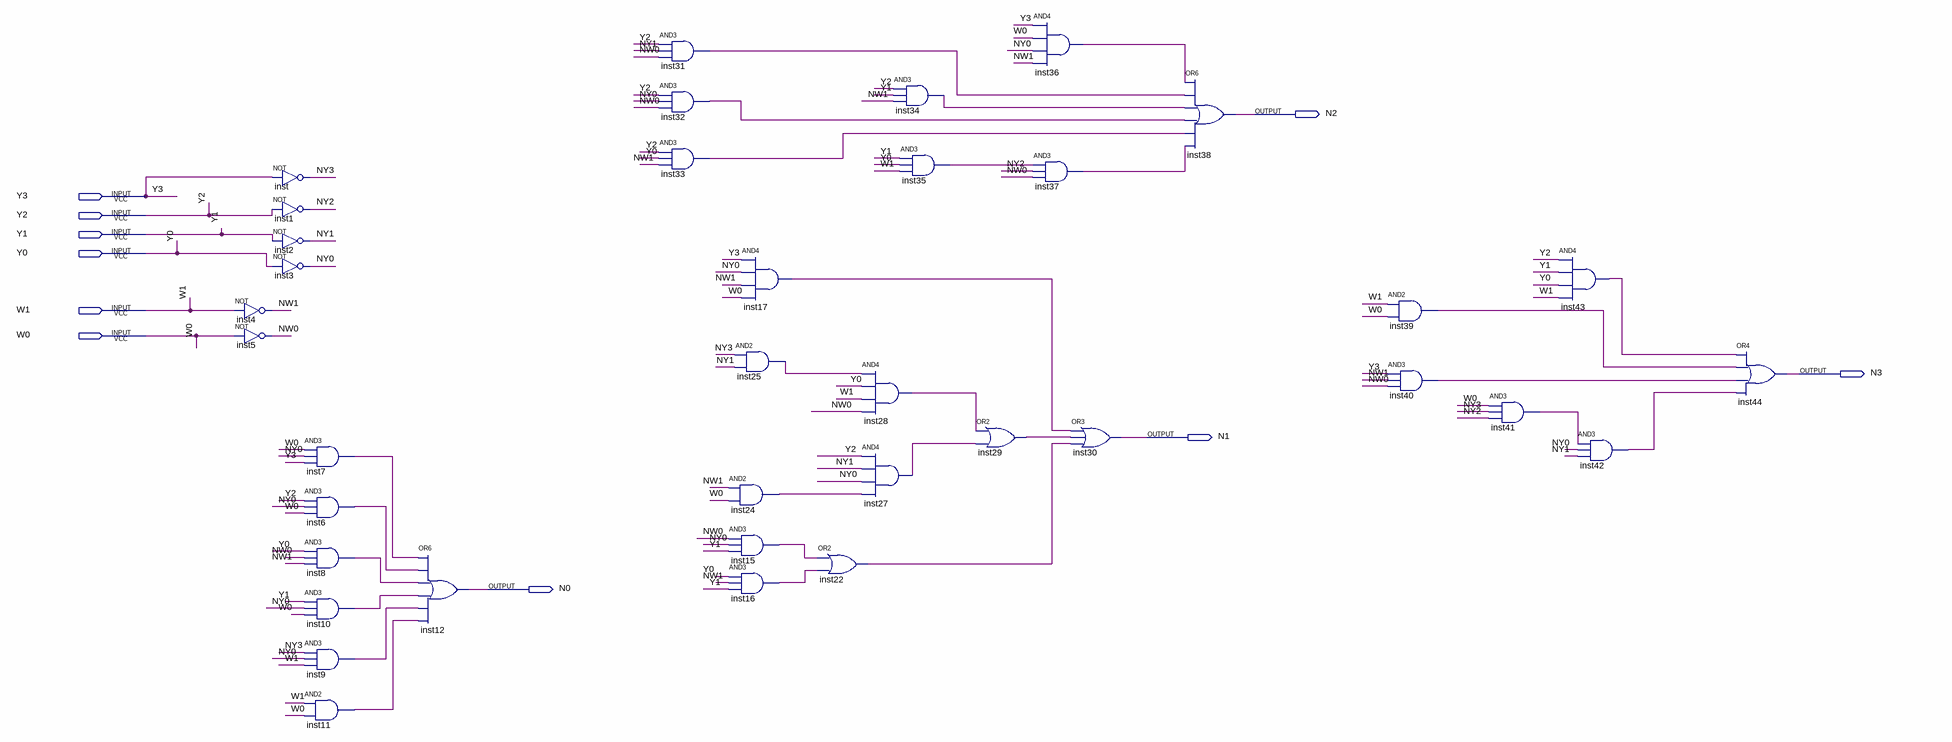
[diagram p0: schematic sheet]
// Quartus schematic CCEntrada.bdf as structural Verilog: 37 symbols, 10 pins
module CCEntrada (
  input  Y3,
  input  Y2,
  input  Y1,
  input  Y0,
  input  W1,
  input  W0,
  output N2,
  output N3,
  output N1,
  output N0
);

  wire inst6_out, inst7_out, inst8_out, inst9_out, inst10_out, inst11_out, inst15_out, inst16_out,
       inst17_out, inst22_out, inst24_out, inst25_out, inst27_out, inst28_out, inst29_out, inst31_out,
       inst32_out, inst33_out, inst34_out, inst35_out, inst36_out, inst37_out, inst39_out, inst40_out,
       inst41_out, inst42_out, inst43_out, NW0, NW1, NY0, NY1, NY2, NY3;

  not inst4 (NW1, W1);
  not inst5 (NW0, W0);
  not inst (NY3, Y3);
  not inst1 (NY2, Y2);
  not inst2 (NY1, Y1);
  not inst3 (NY0, Y0);
  and inst7 (inst7_out, W0, NY0, Y3);
  and inst6 (inst6_out, Y2, NY0, W0);
  and inst8 (inst8_out, Y0, NW0, NW1);
  and inst10 (inst10_out, Y1, NY0, W0);
  and inst9 (inst9_out, NY3, NY0, W1);
  and inst11 (inst11_out, W1, W0);
  or inst12 (N0, inst7_out, inst6_out, inst8_out, inst10_out, inst9_out, inst11_out);
  and inst31 (inst31_out, Y2, NY1, NW0);
  and inst32 (inst32_out, Y2, NY0, NW0);
  and inst33 (inst33_out, Y2, Y0, NW1);
  and inst17 (inst17_out, Y3, NY0, NW1, W0);
  and inst25 (inst25_out, NY3, NY1);
  and inst24 (inst24_out, NW1, W0);
  and inst15 (inst15_out, NW0, NY0, Y1);
  and inst16 (inst16_out, Y0, NW1, Y1);
  or inst22 (inst22_out, inst15_out, inst16_out);
  and inst28 (inst28_out, inst25_out, Y0, W1, NW0);
  and inst27 (inst27_out, Y2, NY1, NY0, inst24_out);
  and inst34 (inst34_out, Y2, Y1, NW1);
  and inst35 (inst35_out, Y1, Y0, W1);
  or inst29 (inst29_out, inst28_out, inst27_out);
  and inst36 (inst36_out, Y3, W0, NY0, NW1);
  and inst37 (inst37_out, inst35_out, NY2, NW0);
  or inst30 (N1, inst17_out, inst29_out, inst22_out);
  or inst38 (N2, inst36_out, inst31_out, inst34_out, inst32_out, inst33_out, inst37_out);
  and inst39 (inst39_out, W1, W0);
  and inst40 (inst40_out, Y3, NW1, NW0);
  and inst41 (inst41_out, W0, NY3, NY2);
  and inst43 (inst43_out, Y2, Y1, Y0, W1);
  and inst42 (inst42_out, inst41_out, NY0, NY1);
  or inst44 (N3, inst43_out, inst39_out, inst40_out, inst42_out);
endmodule
